# EAGLE design jogwheel (EAGLE 6.1)
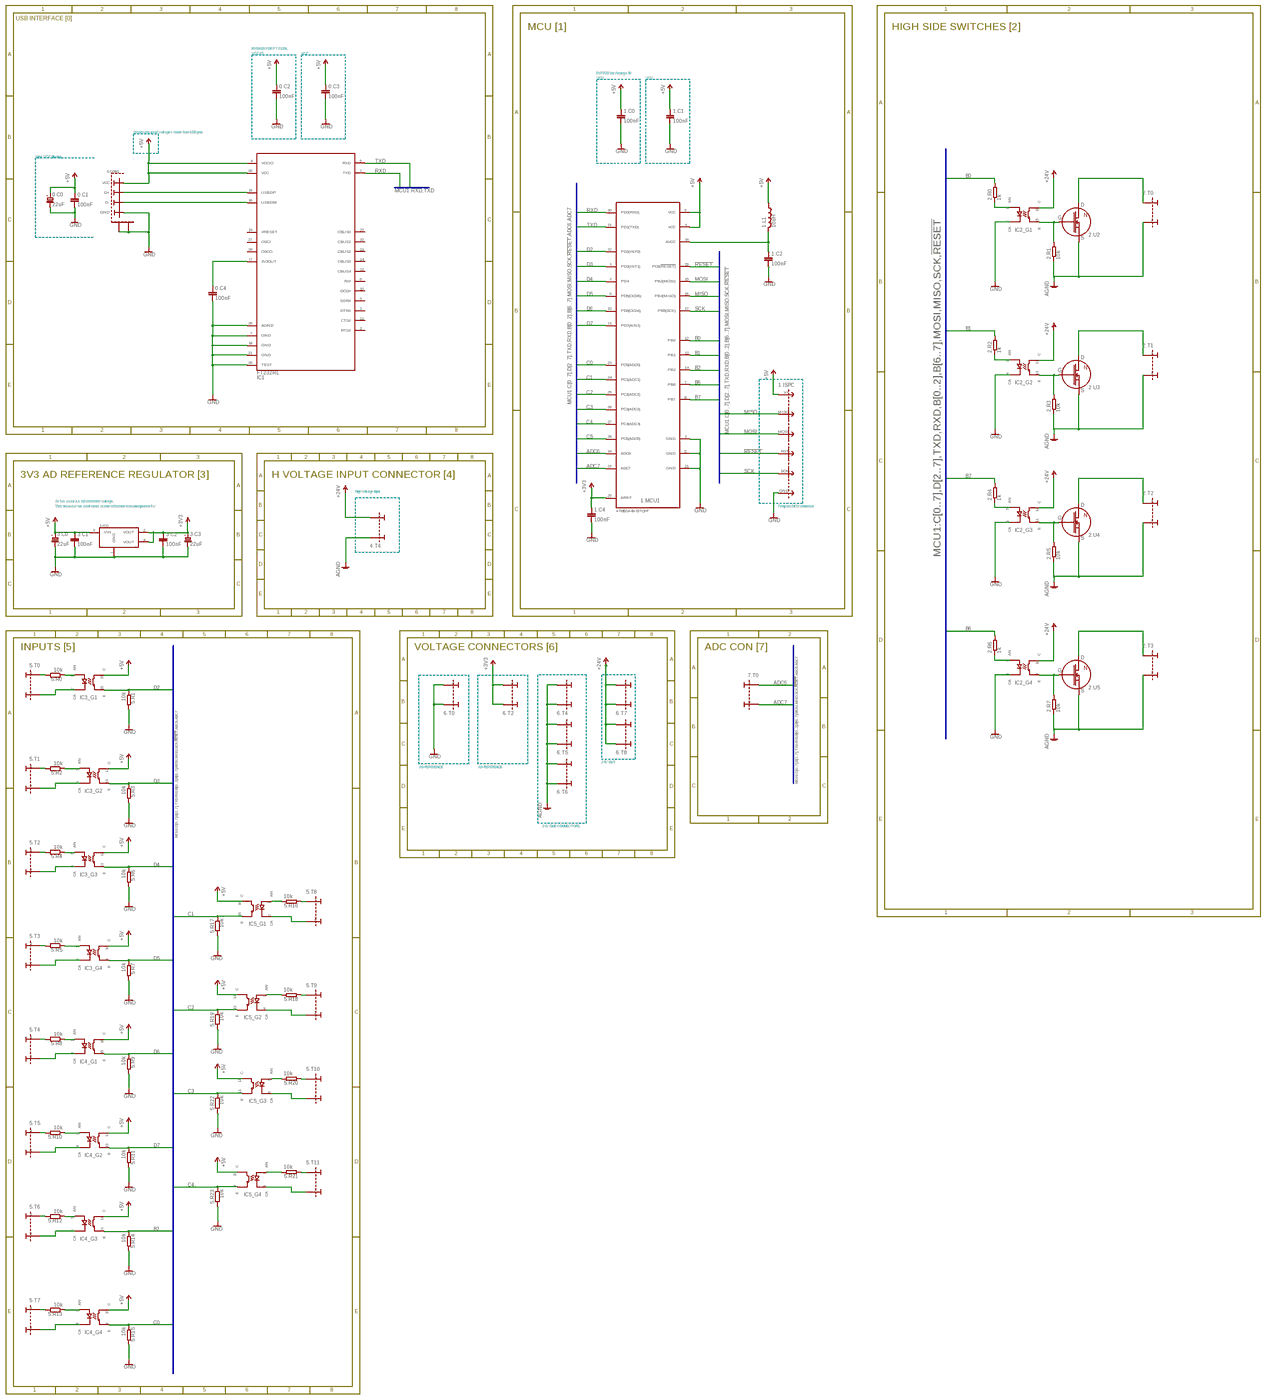
[diagram p0: schematic, sheet 1, overview]
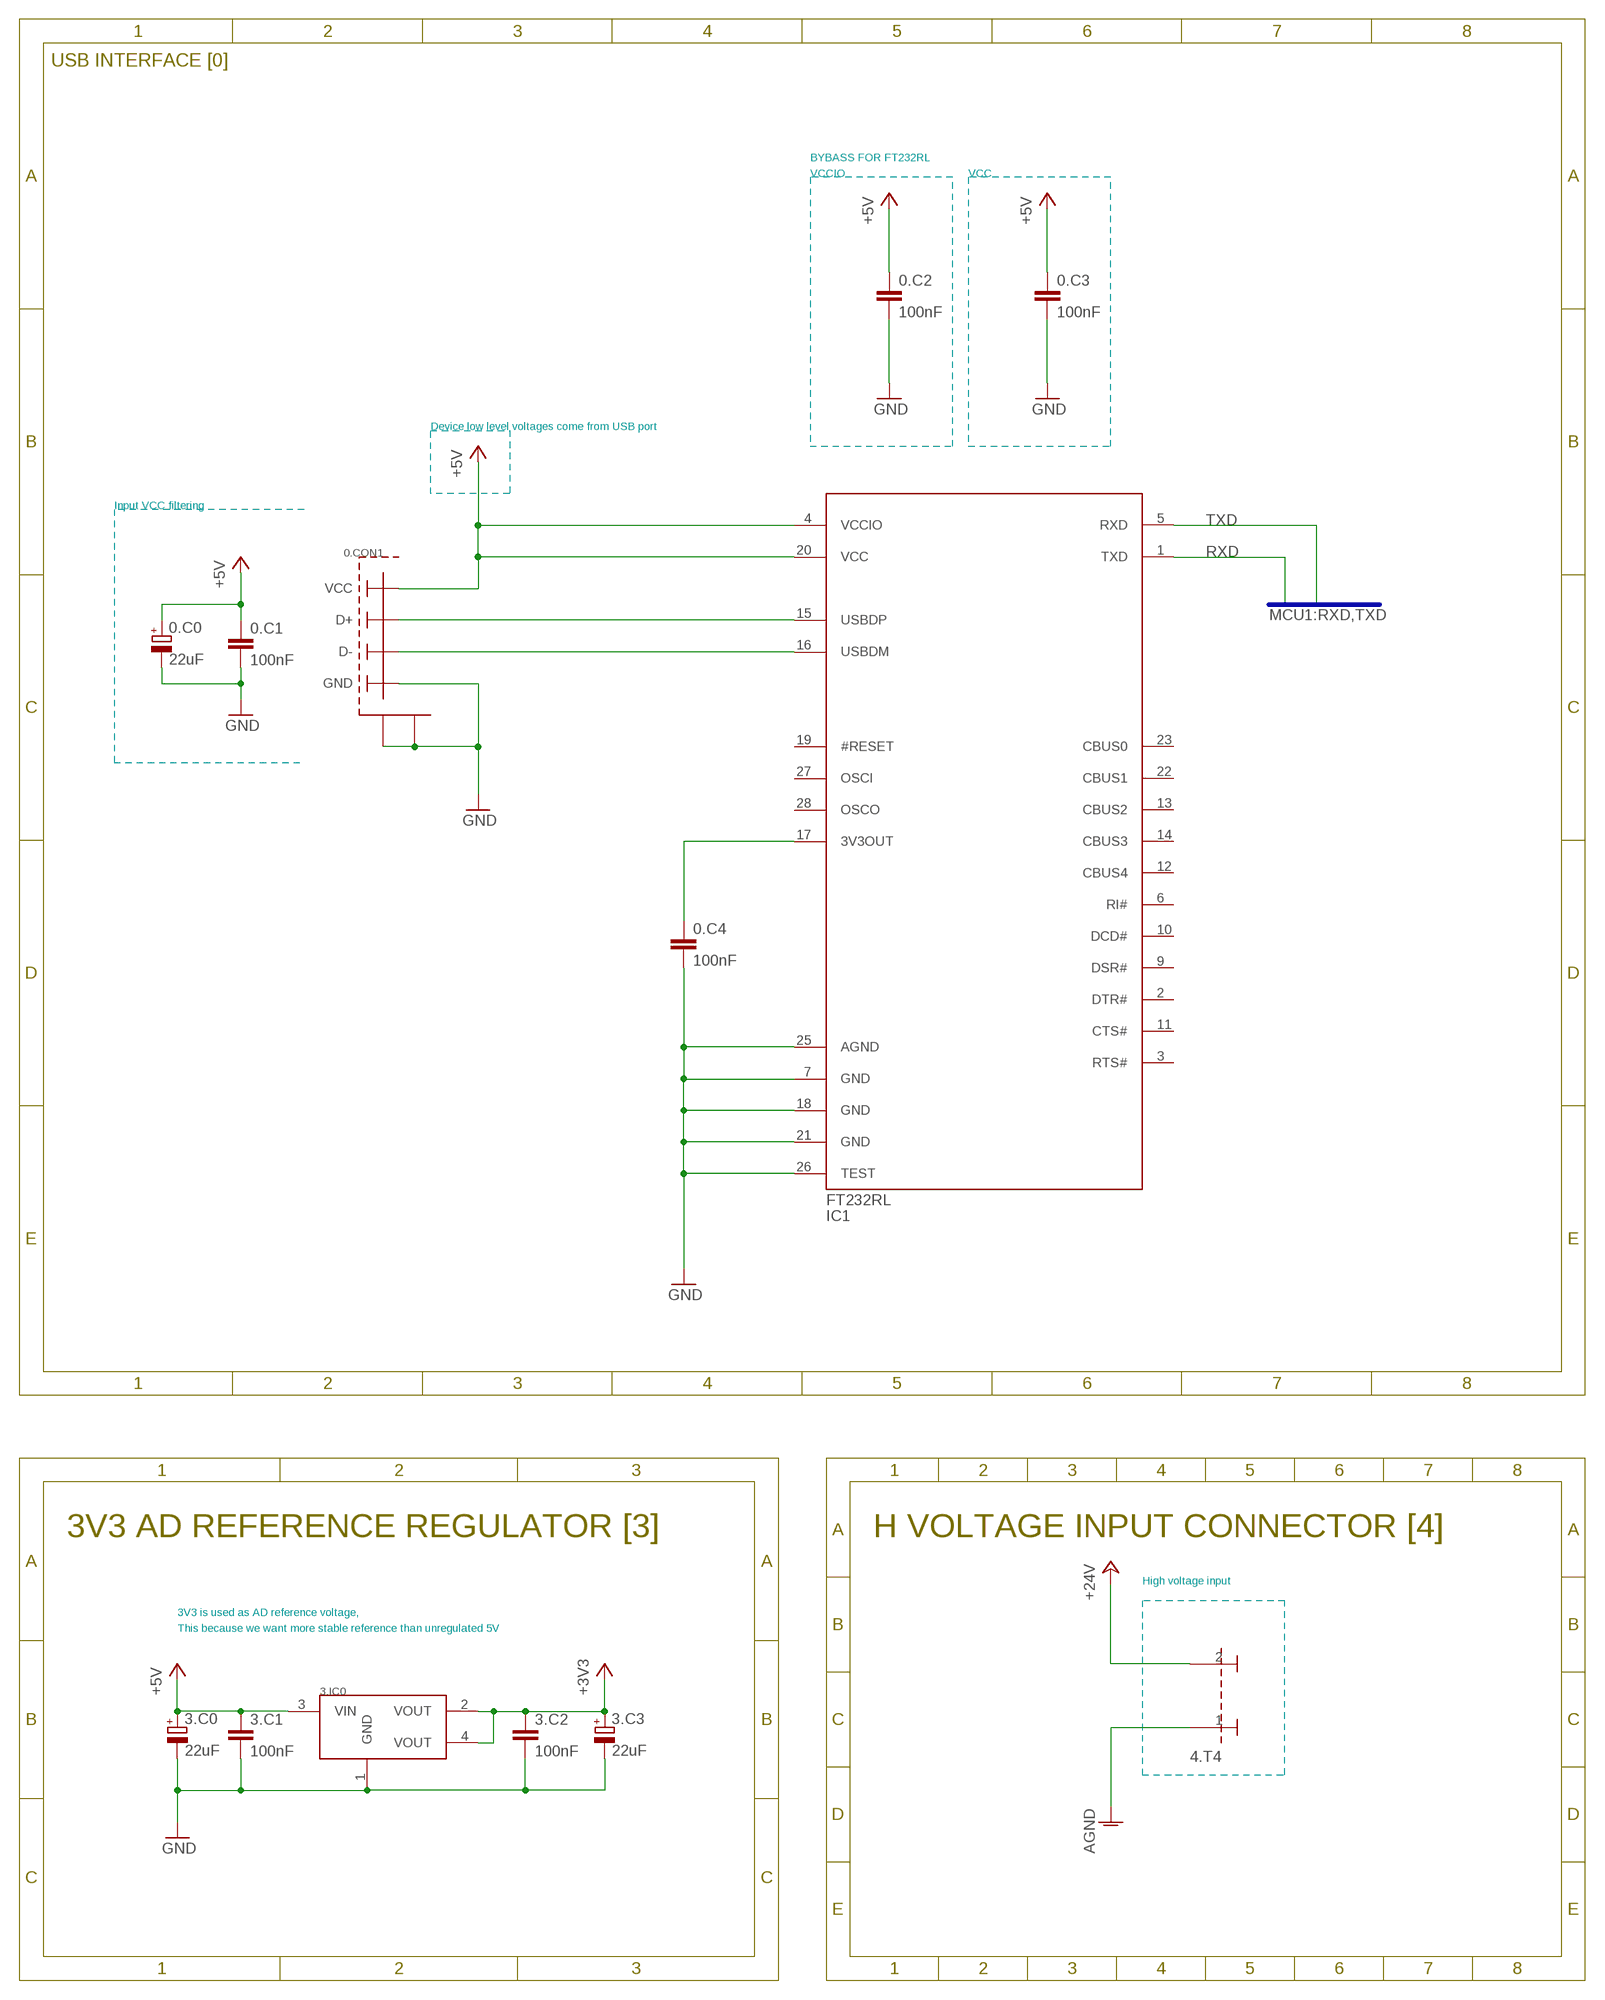
[diagram p1: schematic, sheet 1, part 1 of 4]
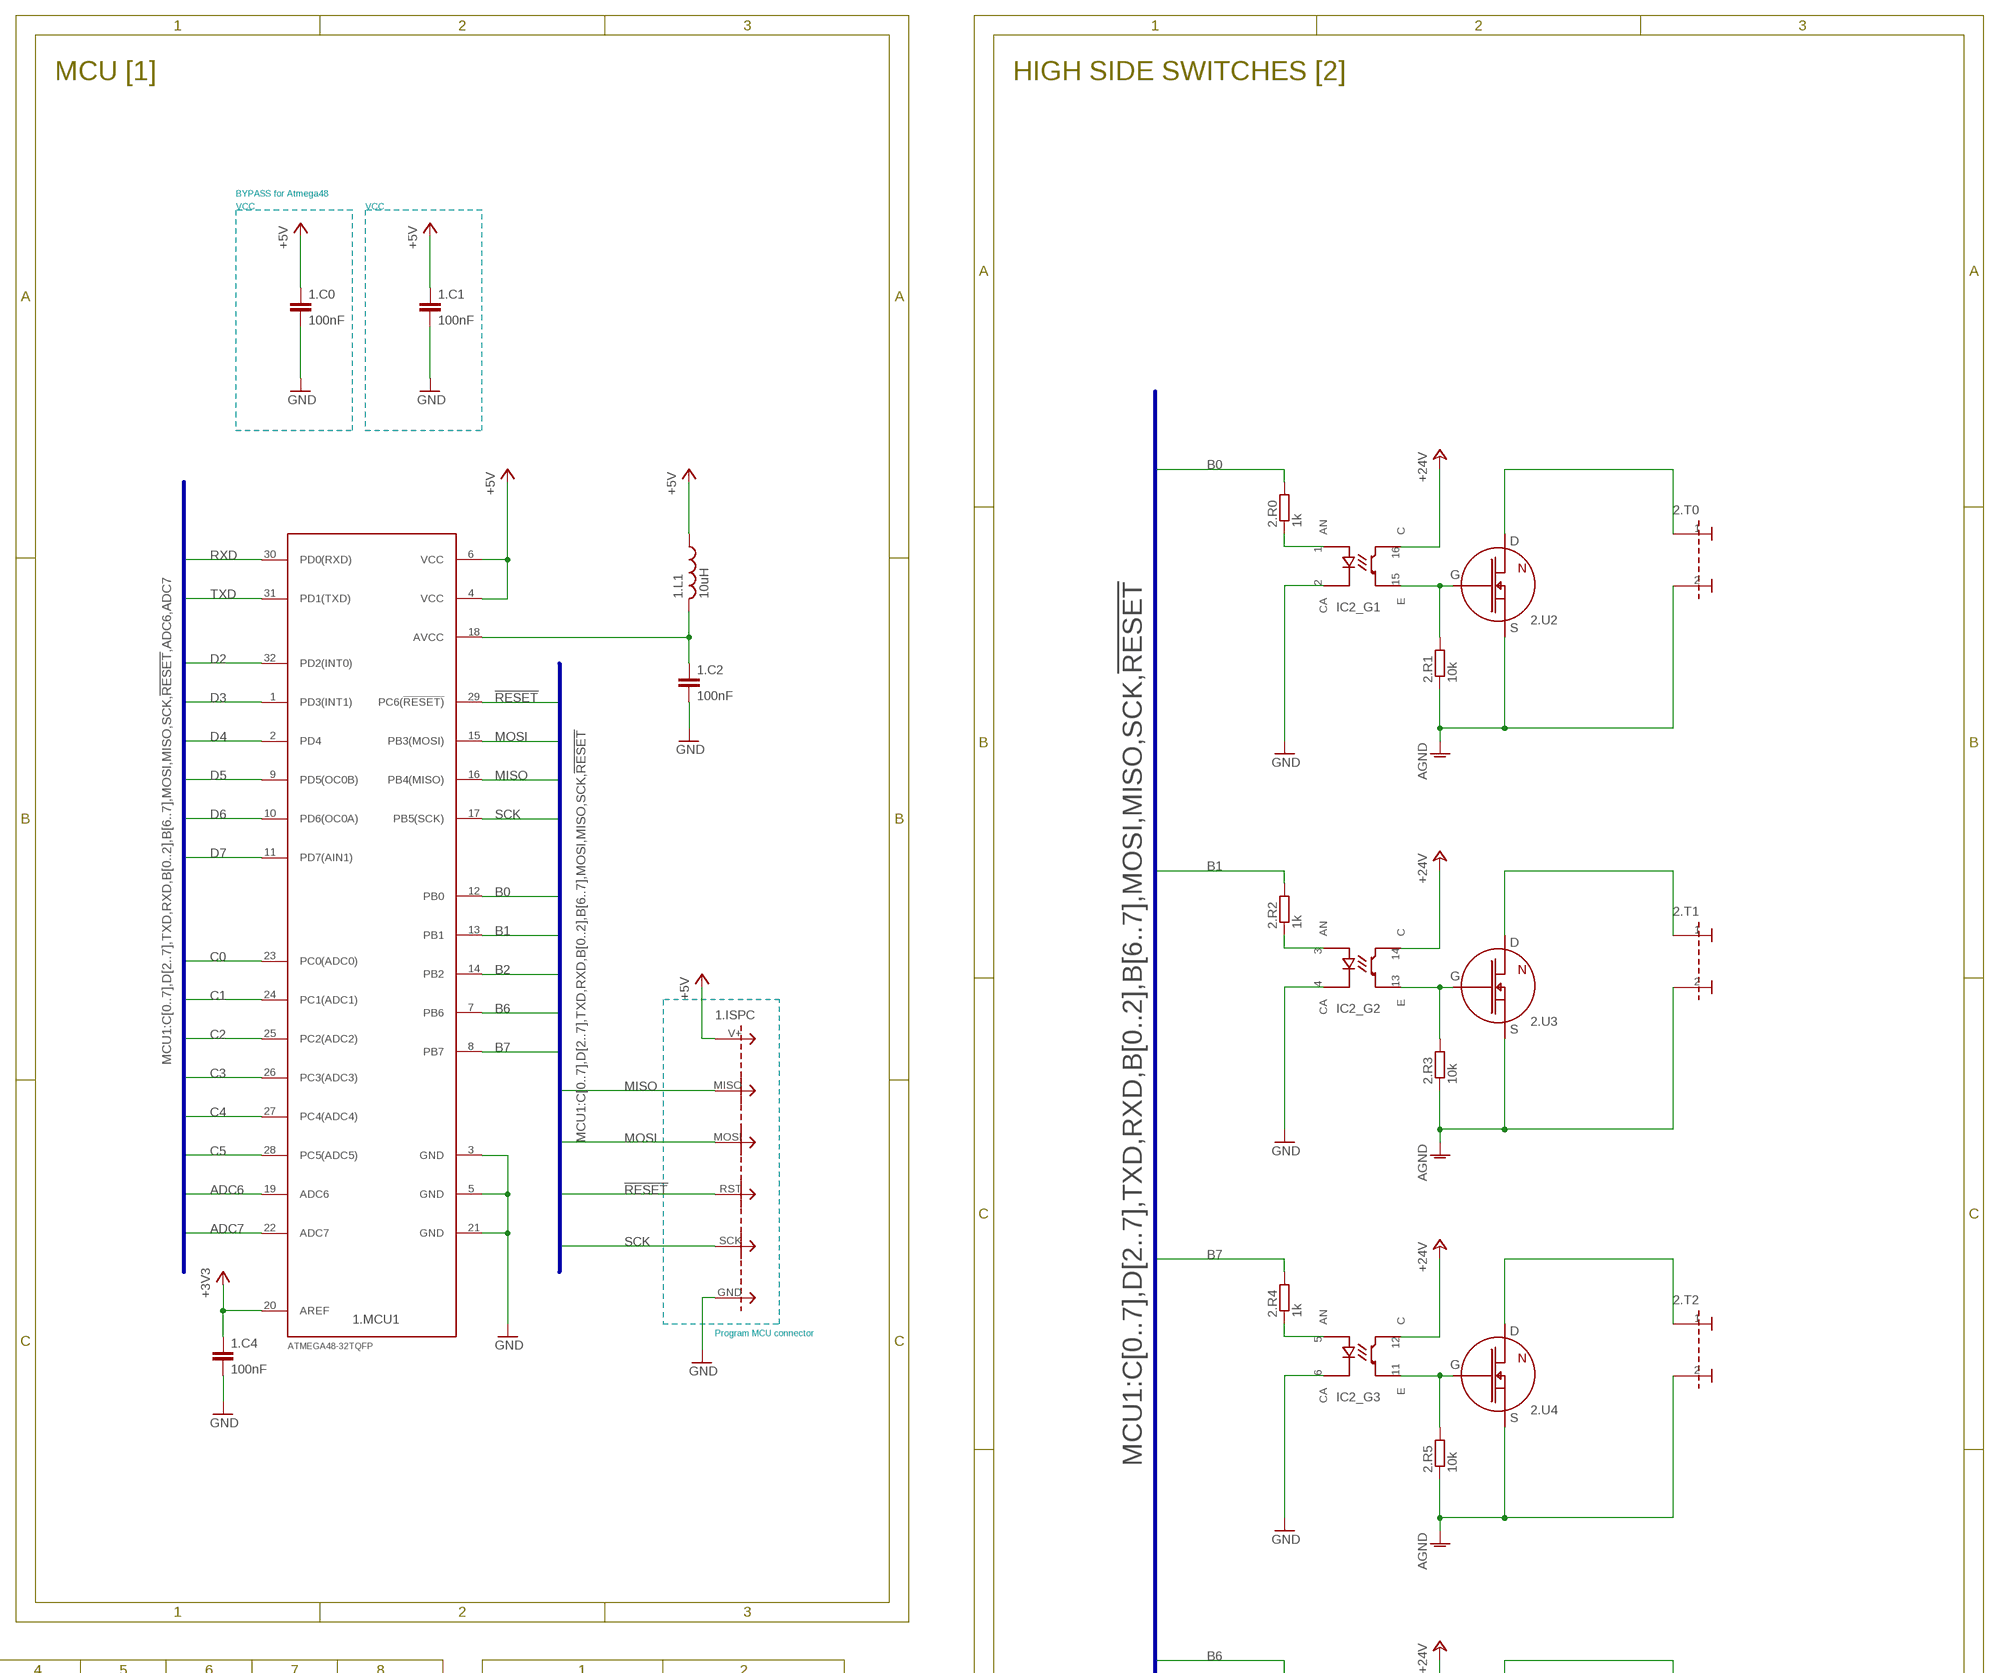
[diagram p2: schematic, sheet 1, part 2 of 4]
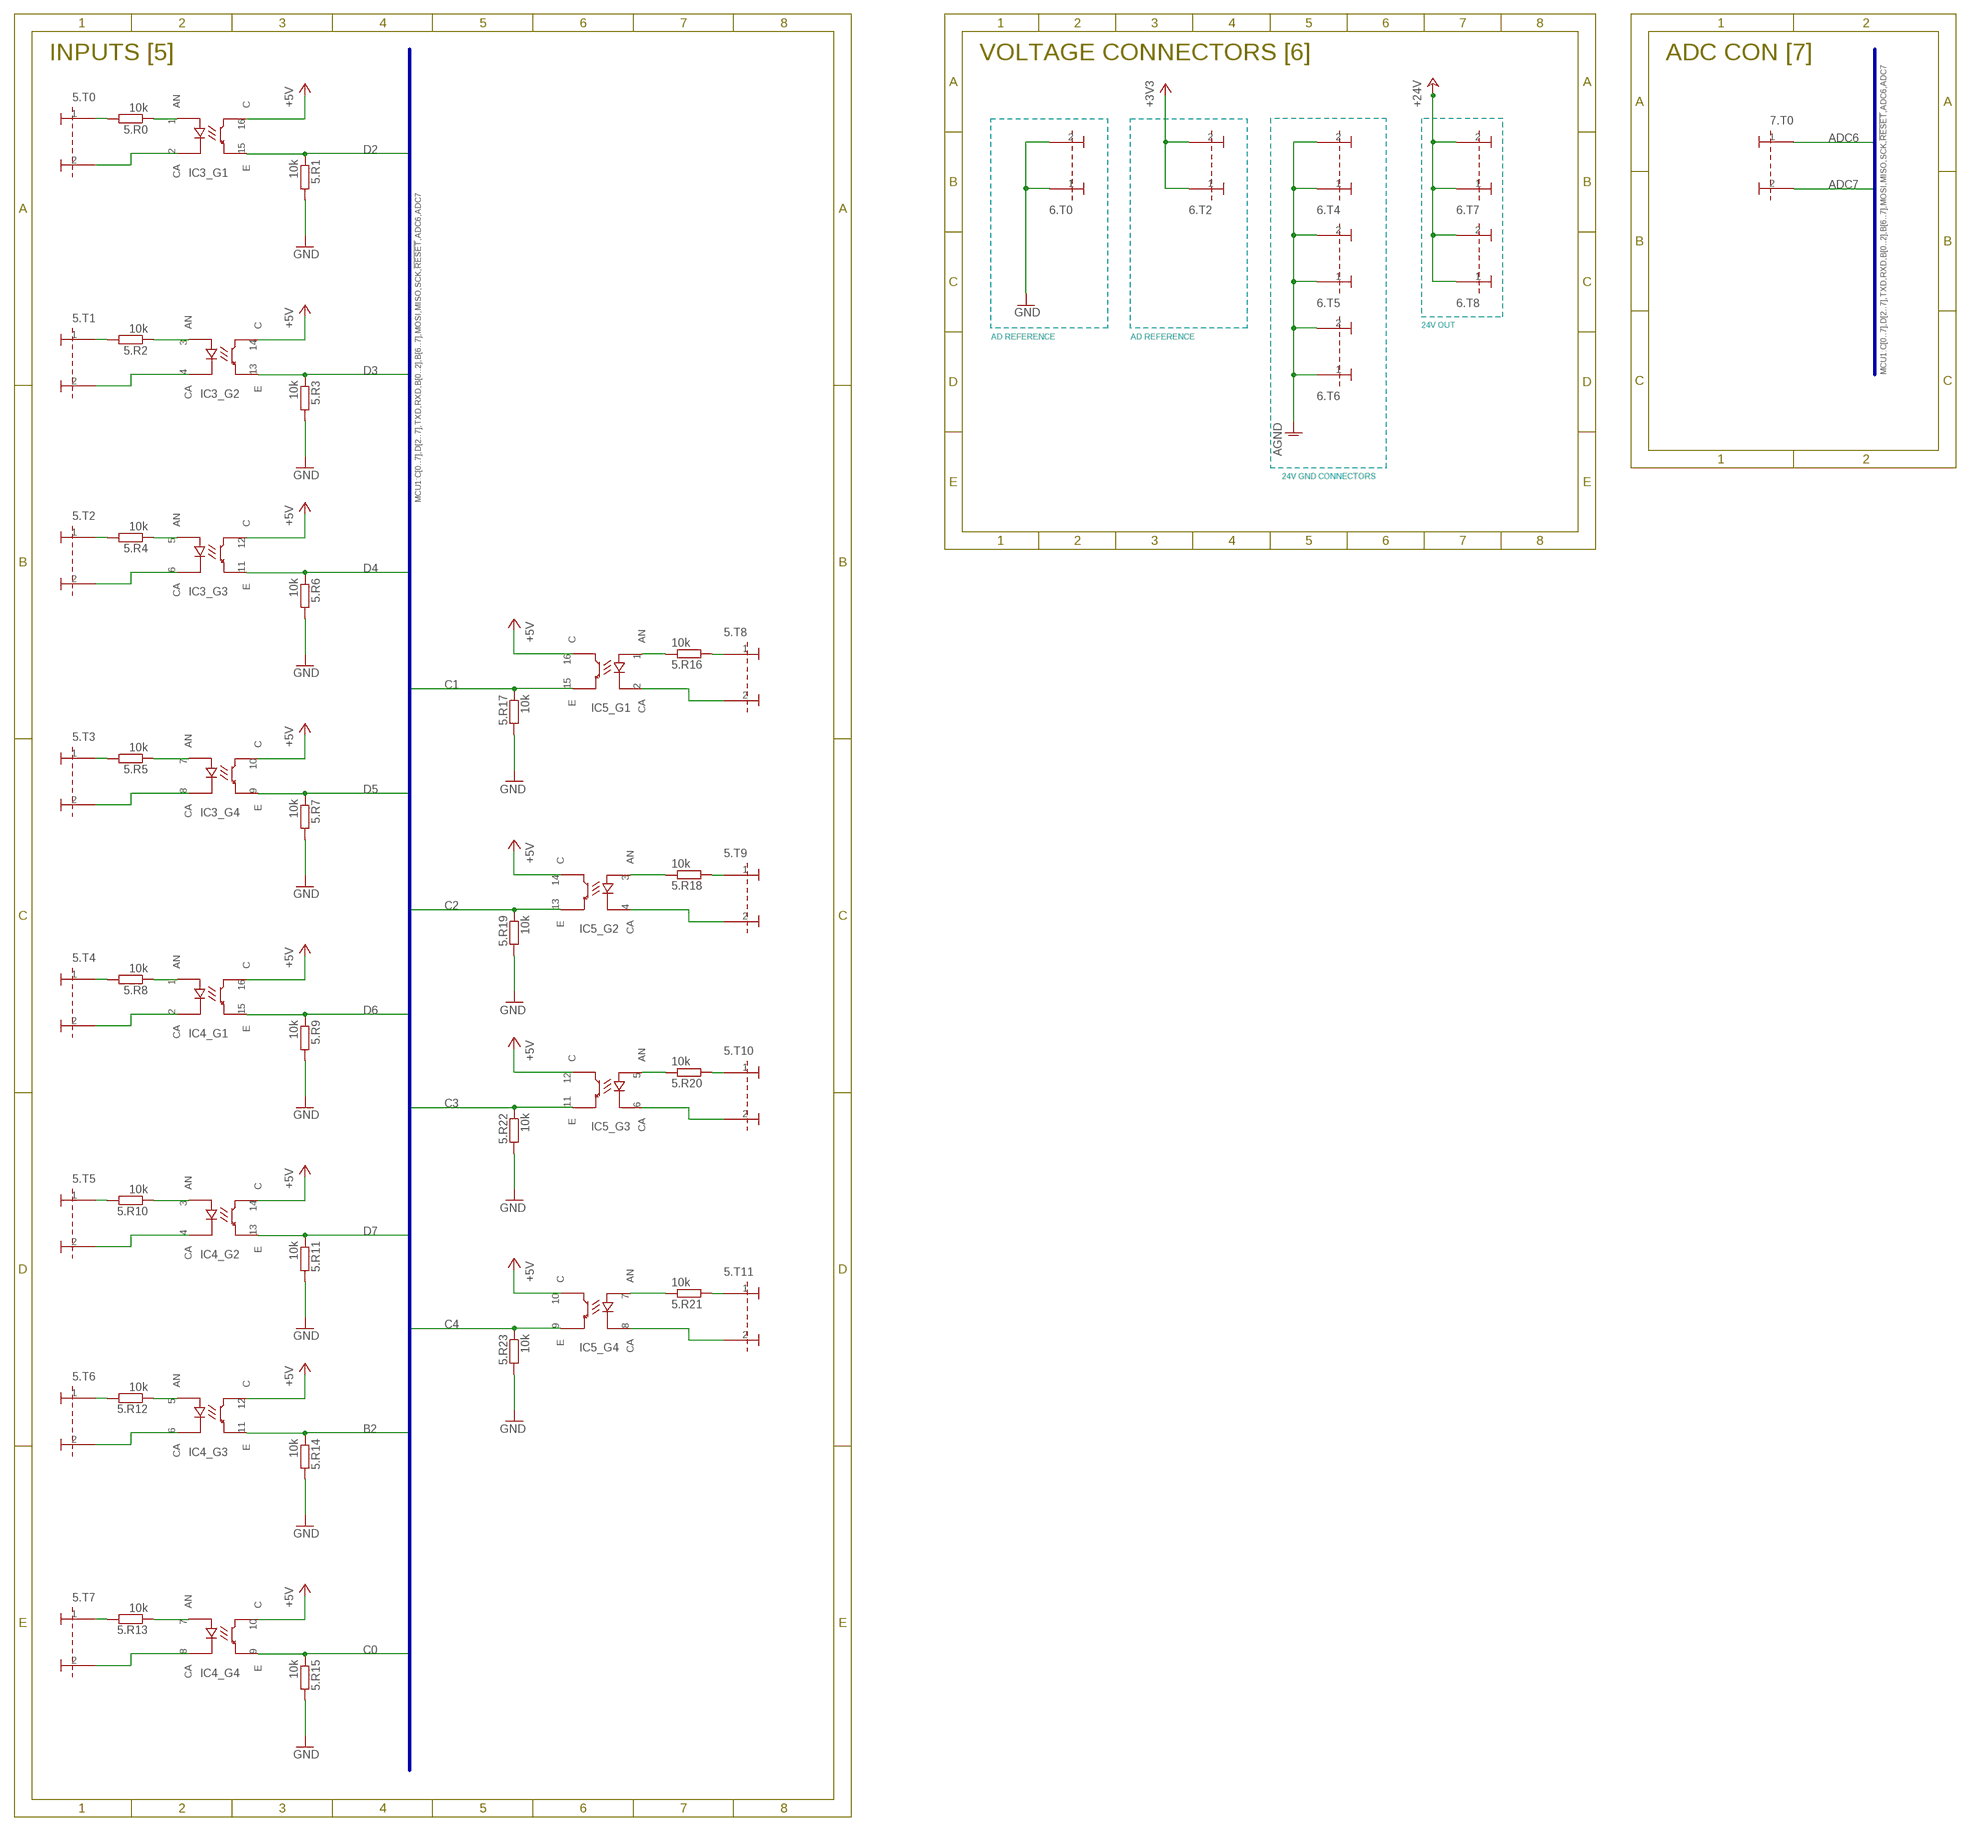
[diagram p3: schematic, sheet 1, part 3 of 4]
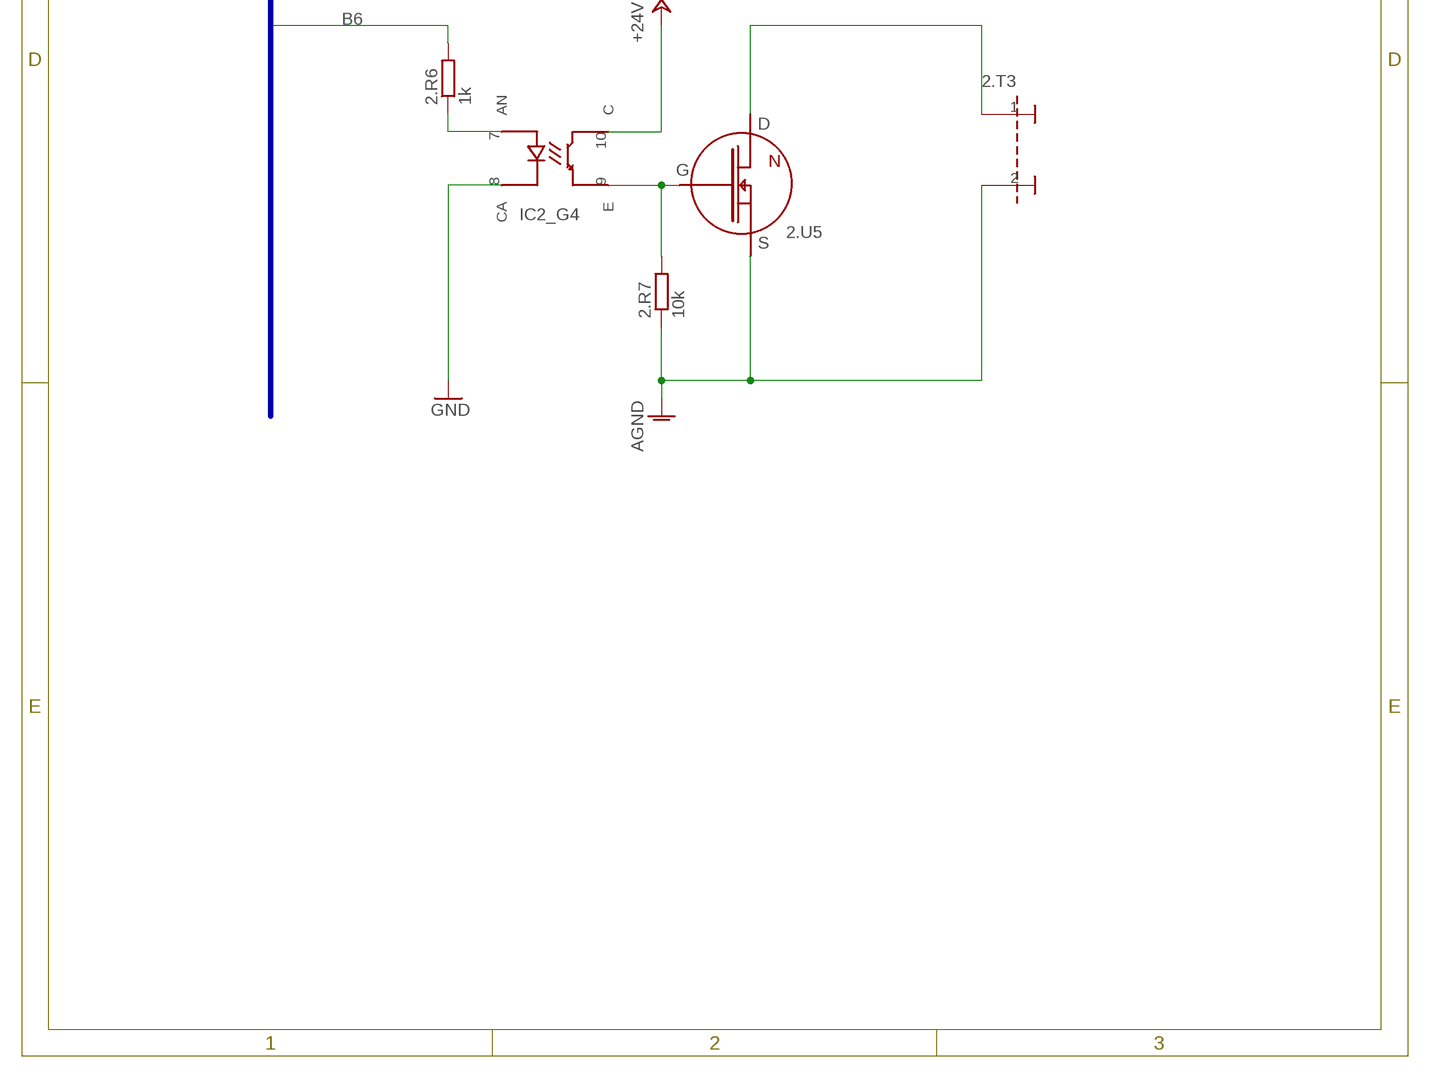
[diagram p4: schematic, sheet 1, part 4 of 4]

## Parts
0.C0  22uF  CPOL-EUE1.5-5  [E1.5-5]
0.C1  100nF  C-EUC0805  [C0805]
0.C2  100nF  C-EUC0805  [C0805]
0.C3  100nF  C-EUC0805  [C0805]
0.C4  100nF  C-EUC0805  [C0805]
0.CON1  USB-BWUERTH-ELECTRONIC-USB-B  [USB-B-THROUGH-HOLE]
1.C0  100nF  C-EUC0805  [C0805]
1.C1  100nF  C-EUC0805  [C0805]
1.C2  100nF  C-EUC0805  [C0805]
1.C4  100nF  C-EUC0805  [C0805]
1.ISPC  CONNECTOR_6PIN2X3_ISP  [2X3_ISP]
1.L1  10uH  L_10UH_0805_LB2012T100KR  [C0805]
1.MCU1  ATMEGA48-20PU-32TQFPTQFP32  [TQFP32-08]
2.R0  1k  R-EU_R0805  [R0805]
2.R1  10k  R-EU_R0805  [R0805]
2.R2  1k  R-EU_R0805  [R0805]
2.R3  10k  R-EU_R0805  [R0805]
2.R4  1k  R-EU_R0805  [R0805]
2.R5  10k  R-EU_R0805  [R0805]
2.R6  1k  R-EU_R0805  [R0805]
2.R7  10k  R-EU_R0805  [R0805]
2.T0  CONNECTOR_2PIN2W-TERMINAL-HEADER-20.155MV/2  [2WAY-TERMINAL-HEADER-20.155MV/2]
2.T1  CONNECTOR_2PIN2W-TERMINAL-HEADER-20.155MV/2  [2WAY-TERMINAL-HEADER-20.155MV/2]
2.T2  CONNECTOR_2PIN2W-TERMINAL-HEADER-20.155MV/2  [2WAY-TERMINAL-HEADER-20.155MV/2]
2.T3  CONNECTOR_2PIN2W-TERMINAL-HEADER-20.155MV/2  [2WAY-TERMINAL-HEADER-20.155MV/2]
2.U2  N_MOSFET_STD6NF10  [STD6NF10]
2.U3  N_MOSFET_STD6NF10  [STD6NF10]
2.U4  N_MOSFET_STD6NF10  [STD6NF10]
2.U5  N_MOSFET_STD6NF10  [STD6NF10]
3.C0  22uF  CPOL-EUE1.5-5  [E1.5-5]
3.C1  100nF  C-EUC0805  [C0805]
3.C2  100nF  C-EUC0805  [C0805]
3.C3  22uF  CPOL-EUE1.5-5  [E1.5-5]
3.IC0  REGULATOR_AP1117E33G-13  [SOT223]
4.T4  CONNECTOR_2PIN2W-TERMINAL-HEADER-20.155MV/2  [2WAY-TERMINAL-HEADER-20.155MV/2]
5.R0  10k  R-EU_R0805  [R0805]
5.R1  10k  R-EU_R0805  [R0805]
5.R2  10k  R-EU_R0805  [R0805]
5.R3  10k  R-EU_R0805  [R0805]
5.R4  10k  R-EU_R0805  [R0805]
5.R5  10k  R-EU_R0805  [R0805]
5.R6  10k  R-EU_R0805  [R0805]
5.R7  10k  R-EU_R0805  [R0805]
5.R8  10k  R-EU_R0805  [R0805]
5.R9  10k  R-EU_R0805  [R0805]
5.R10  10k  R-EU_R0805  [R0805]
5.R11  10k  R-EU_R0805  [R0805]
5.R12  10k  R-EU_R0805  [R0805]
5.R13  10k  R-EU_R0805  [R0805]
5.R14  10k  R-EU_R0805  [R0805]
5.R15  10k  R-EU_R0805  [R0805]
5.R16  10k  R-EU_R0805  [R0805]
5.R17  10k  R-EU_R0805  [R0805]
5.R18  10k  R-EU_R0805  [R0805]
5.R19  10k  R-EU_R0805  [R0805]
5.R20  10k  R-EU_R0805  [R0805]
5.R21  10k  R-EU_R0805  [R0805]
5.R22  10k  R-EU_R0805  [R0805]
5.R23  10k  R-EU_R0805  [R0805]
5.T0  CONNECTOR_2PIN2W-TERMINAL-HEADER-20.155MV/2  [2WAY-TERMINAL-HEADER-20.155MV/2]
5.T1  CONNECTOR_2PIN2W-TERMINAL-HEADER-20.155MV/2  [2WAY-TERMINAL-HEADER-20.155MV/2]
5.T2  CONNECTOR_2PIN2W-TERMINAL-HEADER-20.155MV/2  [2WAY-TERMINAL-HEADER-20.155MV/2]
5.T3  CONNECTOR_2PIN2W-TERMINAL-HEADER-20.155MV/2  [2WAY-TERMINAL-HEADER-20.155MV/2]
5.T4  CONNECTOR_2PIN2W-TERMINAL-HEADER-20.155MV/2  [2WAY-TERMINAL-HEADER-20.155MV/2]
5.T5  CONNECTOR_2PIN2W-TERMINAL-HEADER-20.155MV/2  [2WAY-TERMINAL-HEADER-20.155MV/2]
5.T6  CONNECTOR_2PIN2W-TERMINAL-HEADER-20.155MV/2  [2WAY-TERMINAL-HEADER-20.155MV/2]
5.T7  CONNECTOR_2PIN2W-TERMINAL-HEADER-20.155MV/2  [2WAY-TERMINAL-HEADER-20.155MV/2]
5.T8  CONNECTOR_2PIN2W-TERMINAL-HEADER-20.155MV/2  [2WAY-TERMINAL-HEADER-20.155MV/2]
5.T9  CONNECTOR_2PIN2W-TERMINAL-HEADER-20.155MV/2  [2WAY-TERMINAL-HEADER-20.155MV/2]
5.T10  CONNECTOR_2PIN2W-TERMINAL-HEADER-20.155MV/2  [2WAY-TERMINAL-HEADER-20.155MV/2]
5.T11  CONNECTOR_2PIN2W-TERMINAL-HEADER-20.155MV/2  [2WAY-TERMINAL-HEADER-20.155MV/2]
6.T0  CONNECTOR_2PIN2W-TERMINAL-HEADER-20.155MV/2  [2WAY-TERMINAL-HEADER-20.155MV/2]
6.T2  CONNECTOR_2PIN2W-TERMINAL-HEADER-20.155MV/2  [2WAY-TERMINAL-HEADER-20.155MV/2]
6.T4  CONNECTOR_2PIN2W-TERMINAL-HEADER-20.155MV/2  [2WAY-TERMINAL-HEADER-20.155MV/2]
6.T5  CONNECTOR_2PIN2W-TERMINAL-HEADER-20.155MV/2  [2WAY-TERMINAL-HEADER-20.155MV/2]
6.T6  CONNECTOR_2PIN2W-TERMINAL-HEADER-20.155MV/2  [2WAY-TERMINAL-HEADER-20.155MV/2]
6.T7  CONNECTOR_2PIN2W-TERMINAL-HEADER-20.155MV/2  [2WAY-TERMINAL-HEADER-20.155MV/2]
6.T8  CONNECTOR_2PIN2W-TERMINAL-HEADER-20.155MV/2  [2WAY-TERMINAL-HEADER-20.155MV/2]
7.T0  CONNECTOR_2PIN2W-TERMINAL-HEADER-20.155MV/2  [2WAY-TERMINAL-HEADER-20.155MV/2]
IC1  FT232RL  [SSOP28]
IC2  OPTO_4_CHANNELS  [ACPL-845-O300]
IC3  OPTO_4_CHANNELS  [ACPL-845-O300]
IC4  OPTO_4_CHANNELS  [ACPL-845-O300]
IC5  OPTO_4_CHANNELS  [ACPL-845-O300]

## Nets
!RESET: 1.ISPC.RST 1.MCU1.29(PC6(!RESET))
+3V3: 1.C4.1 1.MCU1.20(AREF) 3.C2.1 3.C3.+ 3.IC0.2(VOUT) 3.IC0.4(VOUT) 6.T2.1 6.T2.2
+5V: 0.C0.+ 0.C1.1 0.C2.1 0.C3.1 0.CON1.VCC 1.C0.1 1.C1.1 1.ISPC.V+ 1.L1.1 1.MCU1.4(VCC) 1.MCU1.6(VCC) 3.C0.+ 3.C1.1 3.IC0.3(VIN) IC1.4(VCCIO) IC1.20(VCC) IC3.10(_G4:C) IC3.12(_G3:C) IC3.14(_G2:C) IC3.16(_G1:C) IC4.10(_G4:C) IC4.12(_G3:C) IC4.14(_G2:C) IC4.16(_G1:C) IC5.10(_G4:C) IC5.12(_G3:C) IC5.14(_G2:C) IC5.16(_G1:C)
+24V: 4.T4.2 6.T7.1 6.T7.2 6.T8.1 6.T8.2 IC2.10(_G4:C) IC2.12(_G3:C) IC2.14(_G2:C) IC2.16(_G1:C)
ADC6: 1.MCU1.19(ADC6) 7.T0.1
ADC7: 1.MCU1.22(ADC7) 7.T0.2
AGND: 2.R1.1 2.R3.1 2.R5.1 2.R7.1 2.T0.2 2.T1.2 2.T2.2 2.T3.2 2.U2.3(S) 2.U3.3(S) 2.U4.3(S) 2.U5.3(S) 4.T4.1 6.T4.1 6.T4.2 6.T5.1 6.T5.2 6.T6.1 6.T6.2
AVCC: 1.C2.1 1.L1.2 1.MCU1.18(AVCC)
B0: 1.MCU1.12(PB0) 2.R0.2
B1: 1.MCU1.13(PB1) 2.R2.2
B2: 1.MCU1.14(PB2) 5.R14.1 IC4.11(_G3:E)
B6: 1.MCU1.7(PB6) 2.R6.2
B7: 1.MCU1.8(PB7) 2.R4.2
C0: 1.MCU1.23(PC0(ADC0)) 5.R15.1 IC4.9(_G4:E)
C1: 1.MCU1.24(PC1(ADC1)) 5.R17.1 IC5.15(_G1:E)
C2: 1.MCU1.25(PC2(ADC2)) 5.R19.1 IC5.13(_G2:E)
C3: 1.MCU1.26(PC3(ADC3)) 5.R22.1 IC5.11(_G3:E)
C4: 1.MCU1.27(PC4(ADC4)) 5.R23.1 IC5.9(_G4:E)
C5: 1.MCU1.28(PC5(ADC5))
D2: 1.MCU1.32(PD2(INT0)) 5.R1.1 IC3.15(_G1:E)
D3: 1.MCU1.1(PD3(INT1)) 5.R3.1 IC3.13(_G2:E)
D4: 1.MCU1.2(PD4) 5.R6.1 IC3.11(_G3:E)
D5: 1.MCU1.9(PD5(OC0B)) 5.R7.1 IC3.9(_G4:E)
D6: 1.MCU1.10(PD6(OC0A)) 5.R9.1 IC4.15(_G1:E)
D7: 1.MCU1.11(PD7(AIN1)) 5.R11.1 IC4.13(_G2:E)
GND: 0.C0.- 0.C1.2 0.C2.2 0.C3.2 0.C4.2 0.CON1.GND 0.CON1.SHIELD 0.CON1.SHIELD@2(SHIELD) 1.C0.2 1.C1.2 1.C2.2 1.C4.2 1.ISPC.GND 1.MCU1.3(GND) 1.MCU1.5(GND) 1.MCU1.21(GND) 3.C0.- 3.C1.2 3.C2.2 3.C3.- 3.IC0.1(GND) 5.R1.2 5.R3.2 5.R6.2 5.R7.2 5.R9.2 5.R11.2 5.R14.2 5.R15.2 5.R17.2 5.R19.2 5.R22.2 5.R23.2 6.T0.1 6.T0.2 IC1.7(GND) IC1.18(GND) IC1.21(GND) IC1.25(AGND) IC1.26(TEST) IC2.2(_G1:CA) IC2.4(_G2:CA) IC2.6(_G3:CA) IC2.8(_G4:CA)
MISO: 1.ISPC.MISO 1.MCU1.16(PB4(MISO))
MOSI: 1.ISPC.MOSI 1.MCU1.15(PB3(MOSI))
N$1 [+24V_SIGNAL]: 2.T2.1 2.U4.2(D)
N$2 [+24V_SIGNAL]: 2.T3.1 2.U5.2(D)
N$3: 0.CON1.D+ IC1.15(USBDP)
N$4: 0.CON1.D- IC1.16(USBDM)
N$5: 2.R5.2 2.U4.1(G) IC2.11(_G3:E)
N$6: 2.R7.2 2.U5.1(G) IC2.9(_G4:E)
N$7: 0.C4.1 IC1.17(3V3OUT)
N$8 [+24V_SIGNAL]: 2.T1.1 2.U3.2(D)
N$9: 2.R3.2 2.U3.1(G) IC2.13(_G2:E)
N$10 [+24V_SIGNAL]: 2.T0.1 2.U2.2(D)
N$11: 2.R1.2 2.U2.1(G) IC2.15(_G1:E)
N$12 [+24V_SIGNAL]: 5.R4.1 IC3.5(_G3:AN)
N$14 [+24V_SIGNAL]: 5.R5.1 IC3.7(_G4:AN)
N$15 [+24V_SIGNAL]: 5.R2.1 IC3.3(_G2:AN)
N$16: 2.R0.1 IC2.1(_G1:AN)
N$17: 2.R6.1 IC2.7(_G4:AN)
N$18 [+24V_SIGNAL]: 5.R2.2 5.T1.1
N$19: 2.R4.1 IC2.5(_G3:AN)
N$20 [+24V_SIGNAL]: 5.R0.1 IC3.1(_G1:AN)
N$21: 2.R2.1 IC2.3(_G2:AN)
N$22 [+24V_SIGNAL]: 5.T0.2 IC3.2(_G1:CA)
N$23 [+24V_SIGNAL]: 5.T1.2 IC3.4(_G2:CA)
N$24 [+24V_SIGNAL]: 5.R0.2 5.T0.1
N$25 [+24V_SIGNAL]: 5.T3.2 IC3.8(_G4:CA)
N$26 [+24V_SIGNAL]: 5.R5.2 5.T3.1
N$27 [+24V_SIGNAL]: 5.T2.2 IC3.6(_G3:CA)
N$28 [+24V_SIGNAL]: 5.R4.2 5.T2.1
N$29 [+24V_SIGNAL]: 5.R8.1 IC4.1(_G1:AN)
N$30 [+24V_SIGNAL]: 5.R10.1 IC4.3(_G2:AN)
N$31 [+24V_SIGNAL]: 5.T5.2 IC4.4(_G2:CA)
N$32 [+24V_SIGNAL]: 5.R10.2 5.T5.1
N$33 [+24V_SIGNAL]: 5.T4.2 IC4.2(_G1:CA)
N$34 [+24V_SIGNAL]: 5.R8.2 5.T4.1
N$35 [+24V_SIGNAL]: 5.R12.1 IC4.5(_G3:AN)
N$36 [+24V_SIGNAL]: 5.R13.1 IC4.7(_G4:AN)
N$37 [+24V_SIGNAL]: 5.T7.2 IC4.8(_G4:CA)
N$38 [+24V_SIGNAL]: 5.R13.2 5.T7.1
N$39 [+24V_SIGNAL]: 5.T6.2 IC4.6(_G3:CA)
N$40 [+24V_SIGNAL]: 5.R12.2 5.T6.1
N$41 [+24V_SIGNAL]: 5.R16.1 IC5.1(_G1:AN)
N$42 [+24V_SIGNAL]: 5.R18.1 IC5.3(_G2:AN)
N$43 [+24V_SIGNAL]: 5.T9.2 IC5.4(_G2:CA)
N$44 [+24V_SIGNAL]: 5.R18.2 5.T9.1
N$45 [+24V_SIGNAL]: 5.T8.2 IC5.2(_G1:CA)
N$46 [+24V_SIGNAL]: 5.R16.2 5.T8.1
N$47 [+24V_SIGNAL]: 5.R20.1 IC5.5(_G3:AN)
N$48 [+24V_SIGNAL]: 5.R21.1 IC5.7(_G4:AN)
N$49 [+24V_SIGNAL]: 5.T11.2 IC5.8(_G4:CA)
N$50 [+24V_SIGNAL]: 5.R21.2 5.T11.1
N$51 [+24V_SIGNAL]: 5.T10.2 IC5.6(_G3:CA)
N$52 [+24V_SIGNAL]: 5.R20.2 5.T10.1
RXD: 1.MCU1.30(PD0(RXD)) IC1.1(TXD)
SCK: 1.ISPC.SCK 1.MCU1.17(PB5(SCK))
TXD: 1.MCU1.31(PD1(TXD)) IC1.5(RXD)
Unconnected: IC1.2(DTR#) IC1.3(RTS#) IC1.6(RI#) IC1.9(DSR#) IC1.10(DCD#) IC1.11(CTS#) IC1.12(CBUS4) IC1.13(CBUS2) IC1.14(CBUS3) IC1.19(#RESET) IC1.22(CBUS1) IC1.23(CBUS0) IC1.27(OSCI) IC1.28(OSCO)

## Buses
MCU1:C[0..7],D[2..7],TXD,RXD,B[0..2],B[6..7],MOSI,MISO,SCK,!RESET
MCU1:C[0..7],D[2..7],TXD,RXD,B[0..2],B[6..7],MOSI,MISO,SCK,!RESET,ADC6,ADC7
MCU1:RXD,TXD

## Notes on the sheet
- USB INTERFACE [0]
- MCU [1] | HIGH SIDE SWITCHES [2]
- BYBASS FOR FT232RL
- VCCIO | VCC
- BYPASS for Atmega48
- VCC | VCC
- Device low level voltages come from USB port
- Input VCC filtering
- 3V3 AD REFERENCE REGULATOR [3] | H VOLTAGE INPUT CONNECTOR [4]
- High voltage input
- 3V3 is used as AD reference voltage,
- This because we want more stable reference than unregulated 5V | Program MCU connector
- INPUTS [5] | VOLTAGE CONNECTORS [6] | ADC CON [7]
- 24V OUT
- AD REFERENCE | AD REFERENCE
- 24V GND CONNECTORS

## Library data of the parts
0.C0 3.C0 3.C3 = RC_and_L:CPOL-EU: POLARIZED CAPACITOR, European symbol
0.C1-0.C4 1.C0 1.C1 1.C2 1.C4 3.C1 3.C2 = RC_and_L:C-EU: CAPACITOR, European symbol
0.CON1 = tlcamera_rail_to_manufacture:USB-B: USB, type B connector.; DATASHEET: http://www.farnell.com/datasheets/1442182.pdf; FARNELL: http://fi.farnell.com/jsp/search/productdetail.jsp?SKU=1642035
1.ISPC = connectors:CONNECTOR_6PIN
1.L1 = jogwheel_parts:L_10UH_0805_LB2012T100KR: TAIYO YUDEN - LB2012T100KR - INDUCTOR, 0805 CASE, 10UH, 120MA, 10% Farnell <http://fi.farnell.com/taiyo-yuden/lb2012t100kr/inductor-0805-case-10uh-120ma-10/dp/1463501>
1.MCU1 = jogwheel_parts:ATMEGA48-20PU-32TQFP
2.R0 2.R1-2.R7 5.R0 5.R1-5.R23 = RC_and_L:R-EU_: RESISTOR, European symbol
2.T0 2.T1-2.T3 = connectors:CONNECTOR_2PIN; PIN1: DRAIN; PIN2: AGND
2.U2-2.U5 = jogwheel_parts:N_MOSFET: MOSFET, N CHANNEL, SINGLE, 3PIN
3.IC0 = jogwheel_parts:REGULATOR: 3V3 Fixed voltage regulator. (2 pins out).; DATASHEET: http://www.farnell.com/datasheets/608751.pdf; FARNELL: http://fi.farnell.com/diodes-inc/ap1117e33g-13/ic-ldo-reg-3-3v-sot223/dp/1825291
4.T4 = connectors:CONNECTOR_2PIN; PIN1: AGND; PIN2: 24VIN
5.T0 5.T1-5.T11 = connectors:CONNECTOR_2PIN; PIN1: V+; PIN2: V-
6.T0 = connectors:CONNECTOR_2PIN; PIN1: GND; PIN2: GND
6.T2 = connectors:CONNECTOR_2PIN; PIN1: AREF; PIN2: AREF
6.T4-6.T6 = connectors:CONNECTOR_2PIN; PIN1: AGND; PIN2: AGND
6.T7 6.T8 = connectors:CONNECTOR_2PIN; PIN1: 24V; PIN2: 24V
7.T0 = connectors:CONNECTOR_2PIN; PIN1: ADC0; PIN2: ADC1
IC1 = jogwheel_parts:FT232RL: FTDI - FT232RL - IC, USB TO UART, SMD, SSOP28, 232; DATASHEET: http://www.farnell.com/datasheets/11529.pdf; FARNELL: http://fi.farnell.com/ftdi/ft232rl/ic-usb-to-uart-smd-ssop28-232/dp/1146032
IC2-IC5 = jogwheel_parts:OPTO_4_CHANNELS: 4 CHANNEL OPTOCOUPLER IC

## Net classes
0 default: width 0.305 mm
1 +24V: width 0.61 mm, clearance 0.305 mm
2 +24V_SIGNAL: width 0.61 mm, clearance 0.305 mm

## Board
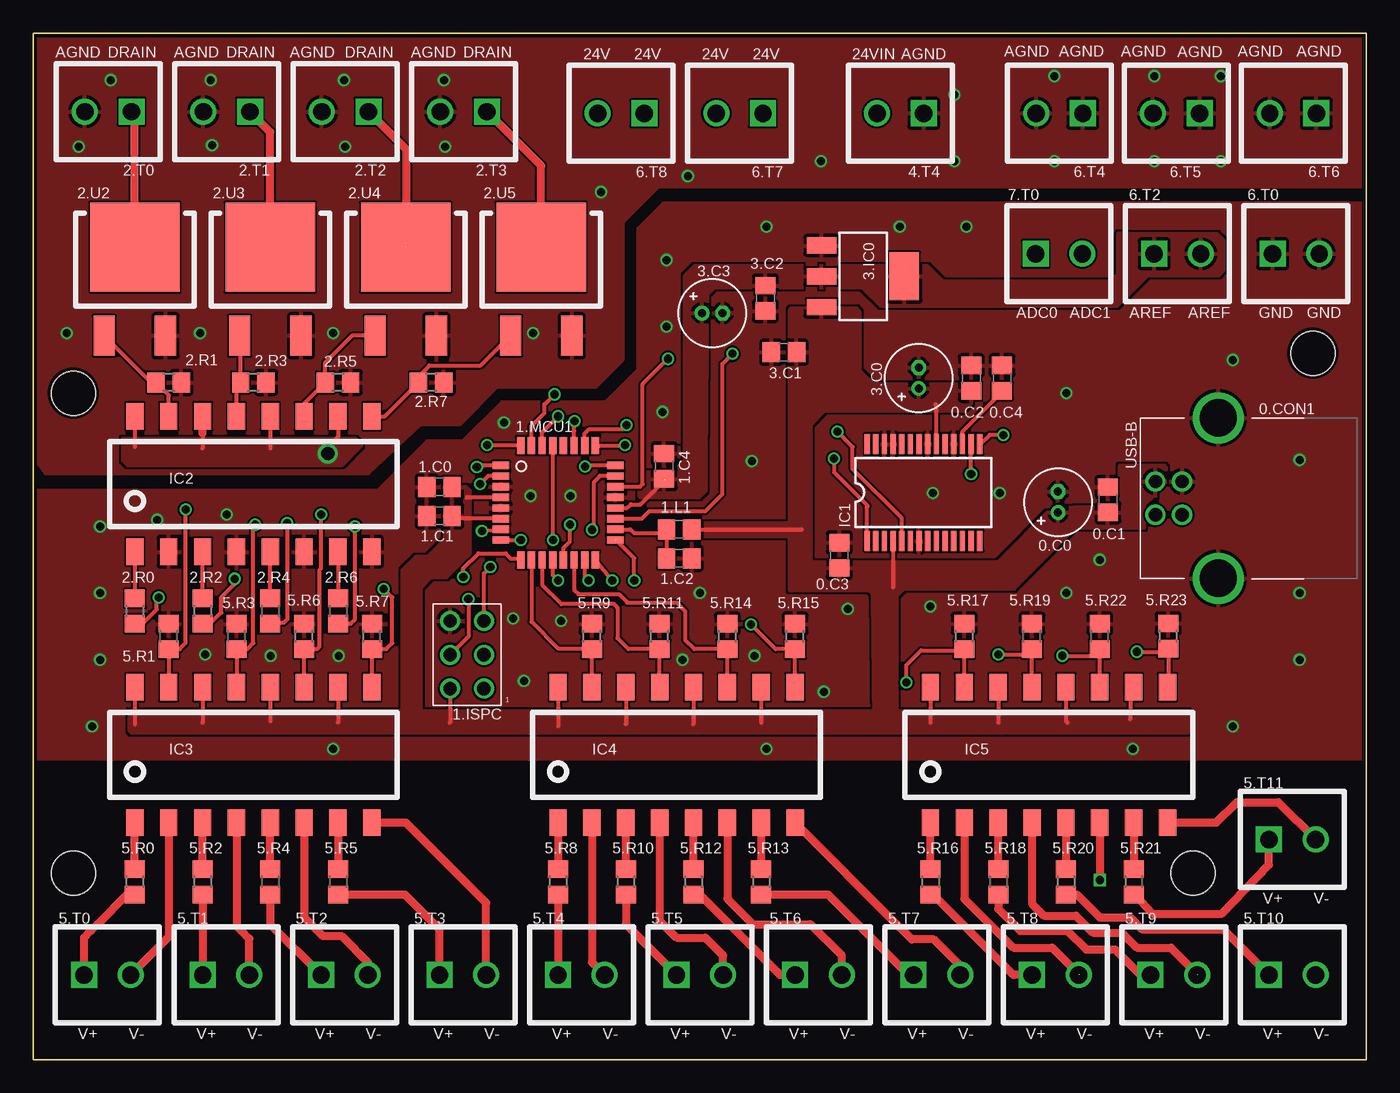
[diagram p5: board, top side]
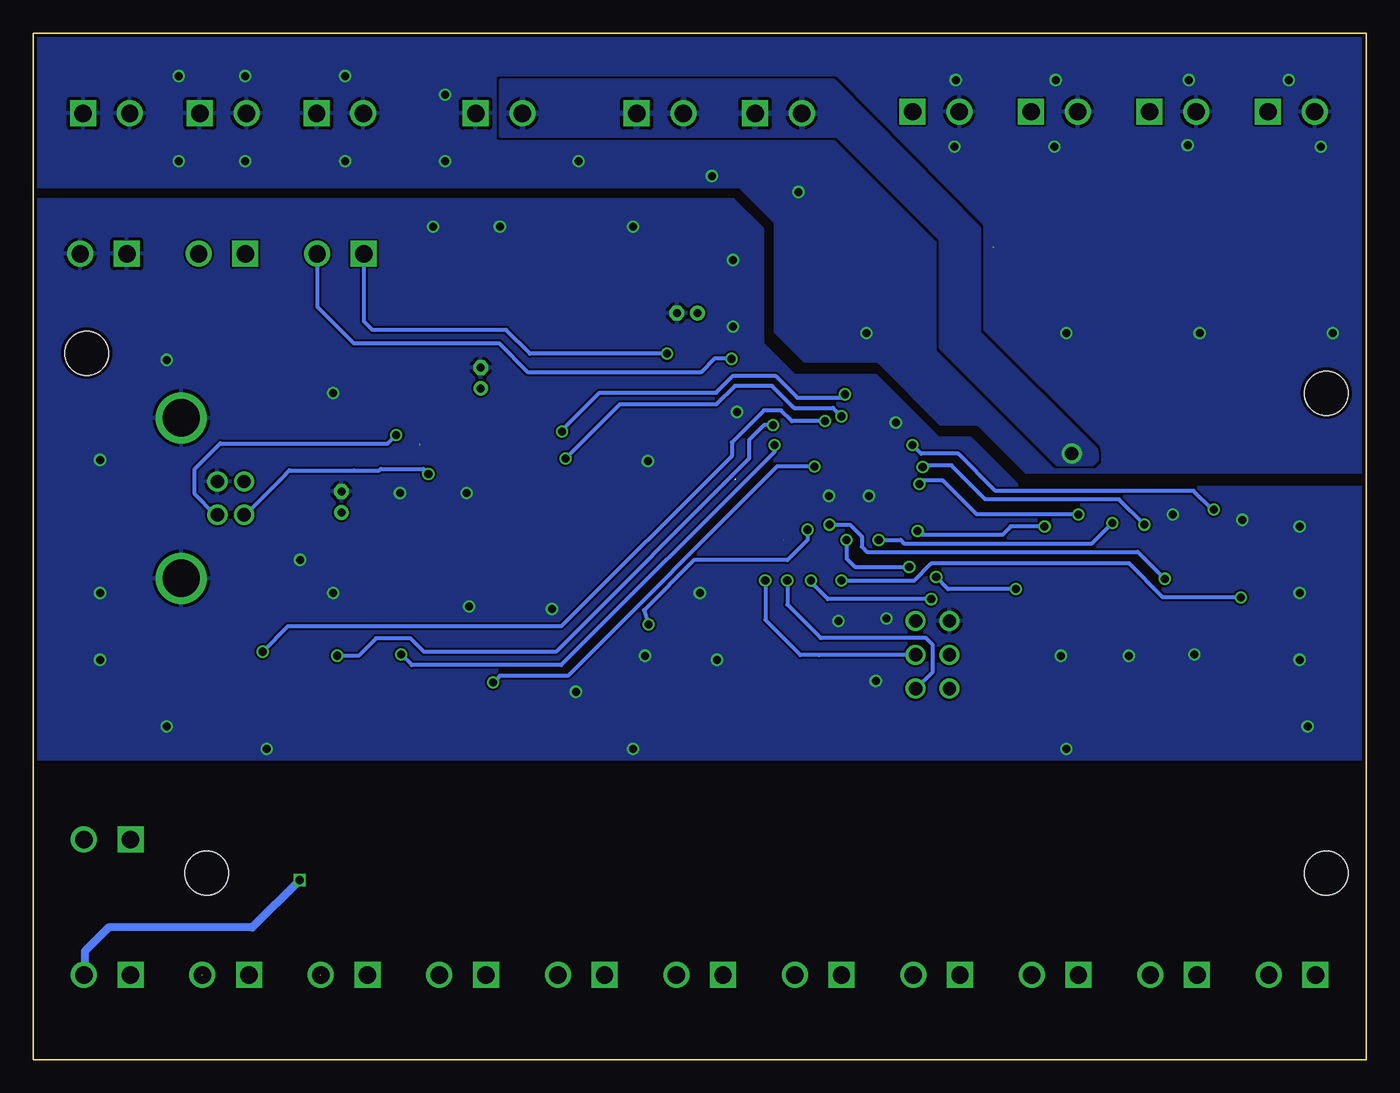
[diagram p6: board, bottom side, seen from below]

Size 100 x 77 mm. Coordinates in mm from the lower left corner, seen from the top.
Outline: 0,0 0,77 100,77 100,0 0,0
Copper layers (1*16): Top 0.035mm / dielectric 1.5mm / Bottom 0.035mm
Design rules: minimum track width 6mil, minimum drill 12mil, track to track 6mil, track to pad 6mil, pad to pad 6mil, via to via 6mil, smd to smd 0mil, copper to edge 10mil, drill to drill 10mil, minimum pad ring 10mil, minimum via ring 6mil, stop-mask expansion 2mil, vias tented up to drill 100mil, thermal gap 10mil
Holes 3.3 mm at 3,14 87,14 96,53 3,50

### Footprints (pad centres in the part's own frame; a part is rotated, then mirrored left to right if it is on the bottom)
E1.5-5 = drill 0.6: + -0.77,0 | drill 0.6 octagon: - 0.79,0
C0805 = smd 1.3 x 1.5: 1 -0.95,0; 2 0.95,0
USB-B-THROUGH-HOLE = drill 1: D+ 7.27,-2.71; D- 7.27,-4.71; GND 4.77,-2.71; VCC 4.77,-4.71 | drill 2.8: SHIELD 0,0; SHIELD@2 12.04,0
2X3_ISP = drill 1: GND 1.27,-5.08; MISO -1.27,0; MOSI 1.27,-2.54; RST -1.27,-5.08; SCK -1.27,-2.54; V+ 1.27,0
TQFP32-08 = smd 1.27 x 0.559: 1 -4.293,2.8; 2 -4.293,2; 3 -4.293,1.2; 4 -4.293,0.4; 5 -4.293,-0.4; 6 -4.293,-1.2; 7 -4.293,-2; 8 -4.293,-2.8; 17 4.293,-2.8; 18 4.293,-2; 19 4.293,-1.2; 20 4.293,-0.4; 21 4.293,0.4; 22 4.293,1.2; 23 4.293,2; 24 4.293,2.8 | smd 0.559 x 1.27: 9 -2.8,-4.293; 10 -2,-4.293; 11 -1.2,-4.293; 12 -0.4,-4.293; 13 0.4,-4.293; 14 1.2,-4.293; 15 2,-4.293; 16 2.8,-4.293; 25 2.8,4.293; 26 2,4.293; 27 1.2,4.293; 28 0.4,4.293; 29 -0.4,4.293; 30 -1.2,4.293; 31 -2,4.293; 32 -2.8,4.293
R0805 = smd 1.3 x 1.5: 1 -0.95,0; 2 0.95,0
2WAY-TERMINAL-HEADER-20.155MV/2 = drill 1.3 square: 1 0,0 | drill 1.3: 2 3.5,0
STD6NF10 = smd 1.6 x 3: 1 -2.3,-6.65; 3 2.3,-6.65 | smd 6.7 x 6.7: 2 0,0
SOT223 = smd 1.219 x 2.235: 1 -2.311,-3.099; 2 0,-3.099; 3 2.311,-3.099 | smd 3.6 x 2.2: 4 0,3.099
SSOP28 = smd 0.4 x 1.5: 1 -4.225,-3.625; 2 -3.575,-3.625; 3 -2.925,-3.625; 4 -2.275,-3.625; 5 -1.625,-3.625; 6 -0.975,-3.625; 7 -0.325,-3.625; 8 0.325,-3.625; 9 0.975,-3.625; 10 1.625,-3.625; 11 2.275,-3.625; 12 2.925,-3.625; 13 3.575,-3.625; 14 4.225,-3.625; 15 4.225,3.625; 16 3.575,3.625; 17 2.925,3.625; 18 2.275,3.625; 19 1.625,3.625; 20 0.975,3.625; 21 0.325,3.625; 22 -0.325,3.625; 23 -0.975,3.625; 24 -1.625,3.625; 25 -2.275,3.625; 26 -2.925,3.625; 27 -3.575,3.625; 28 -4.225,3.625
ACPL-845-O300 = smd 1.3 x 2: 1 0,-10.16; 2 2.54,-10.16; 3 5.08,-10.16; 4 7.62,-10.16; 5 10.16,-10.16; 6 12.7,-10.16; 7 15.24,-10.16; 8 17.78,-10.16; 9 17.78,0; 10 15.24,0; 11 12.7,0; 12 10.16,0; 13 7.62,0; 14 5.08,0; 15 2.54,0; 16 0,0

### Placement (x,y rotation side)
0.C0  76.88,41.82 90 top
0.C1  80.62,42.01 90 top
0.C2  70.38,51.13 90 top
0.C3  60.47,37.84 90 top
0.C4  72.67,51.13 90 top
0.CON1  88.9,48.14 270 top
1.C0  30.47,42.97 180 top
1.C1  30.47,40.8 180 top
1.C2  48.45,37.61 0 top
1.C4  47.33,44.51 90 top
1.ISPC  32.54,27.83 180 top
1.L1  48.45,39.78 180 top
1.MCU1  39.37,41.78 0 top
2.R0  7.62,33.66 270 top
2.R1  10.16,50.8 180 top
2.R2  12.7,33.66 270 top
2.R3  16.51,50.8 180 top
2.R4  17.78,33.66 270 top
2.R5  22.86,50.8 180 top
2.R6  22.86,33.66 270 top
2.R7  29.84,50.8 180 top
2.T0  7.37,71.12 180 top
2.T1  16.25,71.12 180 top
2.T2  25.14,71.12 180 top
2.T3  34.03,71.12 180 top
2.U2  7.62,60.96 0 top
2.U3  17.78,60.96 0 top
2.U4  27.94,60.96 0 top
2.U5  38.1,60.96 0 top
3.C0  66.43,51.13 90 top
3.C1  56.31,53.06 180 top
3.C2  54.93,57.12 270 top
3.C3  50.93,56.01 0 top
3.IC0  62.25,58.77 270 top
4.T4  66.8,71 180 top
5.R0  7.62,13.34 270 top
5.R1  10.16,31.75 90 top
5.R2  12.7,13.34 270 top
5.R3  15.24,31.75 90 top
5.R4  17.78,13.34 270 top
5.R5  22.86,13.34 270 top
5.R6  20.32,31.75 90 top
5.R7  25.4,31.75 90 top
5.R8  39.37,13.34 270 top
5.R9  41.91,31.75 90 top
5.R10  44.45,13.34 270 top
5.R11  46.99,31.75 90 top
5.R12  49.53,13.34 270 top
5.R13  54.61,13.34 270 top
5.R14  52.07,31.75 90 top
5.R15  57.15,31.75 90 top
5.R16  67.31,13.34 270 top
5.R17  69.85,31.75 90 top
5.R18  72.39,13.34 270 top
5.R19  74.93,31.75 90 top
5.R20  77.47,13.34 270 top
5.R21  82.55,13.34 270 top
5.R22  80.01,31.75 90 top
5.R23  85.15,31.77 90 top
5.T0  3.81,6.35 0 top
5.T1  12.7,6.35 0 top
5.T2  21.59,6.35 0 top
5.T3  30.48,6.35 0 top
5.T4  39.37,6.35 0 top
5.T5  48.26,6.35 0 top
5.T6  57.15,6.35 0 top
5.T7  66.04,6.35 0 top
5.T8  74.93,6.35 0 top
5.T9  83.82,6.35 0 top
5.T10  92.71,6.35 0 top
5.T11  92.71,16.51 0 top
6.T0  92.98,60.46 0 top
6.T2  84.09,60.46 0 top
6.T4  78.74,71 180 top
6.T5  87.5,71 180 top
6.T6  96.27,71 180 top
6.T7  54.74,71 180 top
6.T8  45.85,71 180 top
7.T0  75.2,60.46 0 top
IC1  66.78,42.55 0 top
IC2  7.62,48.26 0 top
IC3  7.62,27.94 0 top
IC4  39.37,27.94 0 top
IC5  67.31,27.94 0 top

### Tracks (layer width: path | path; a pad name or v marks a point on that pad's centre or on a via)
!RESET  (via drill 0.61)
  Top 0.305: 1.MCU1.29 38.97,39.01 v38.99,38.99 | 34.04,36.7 v34.29,36.96 33.81,36.48 1.ISPC.RST
  Bottom 0.305: v38.99,38.99 38.99,37.59 38.35,36.96 v34.29,36.96
+3V3  (1 unrouted)
  Top 0.305: 1.MCU1.20 44.56,41.38 44.83,41.66 45.56,41.66 47.4,43.5
  pour Top: 81.53,61.98 88.77,61.98 89.28,61.47 89.28,59.18 88.9,58.8 83.57,58.8 81.28,56.52 63.63,56.52 62.36,57.78 62.23,57.91 56.52,57.91 56.52,59.56 67.06,59.56 68.2,58.42 80.9,58.42 81.41,58.93 81.41,61.98
  pour Top: 56.64,57.91 51.05,57.91 50.55,57.4 50.42,44.7 50.42,42.67 49.91,42.16 45.59,42.16 45.47,42.29 45.47,44.07 48.01,44.07 48.9,44.96 48.9,58.8 49.66,59.56 56.64,59.56 56.77,59.44
+5V
  Top 0.305: IC3.16 7.62,25.15 | IC3.14 12.7,25.27 | IC3.12 17.78,25.4 | IC3.10 22.86,25.27 | IC4.16 39.37,25.02 | IC4.14 44.45,25.15 | IC4.12 49.53,25.15 | IC4.10 54.61,25.27 | IC5.16 67.31,25.27 | IC5.14 72.39,25.27 | IC5.12 77.47,25.4 77.6,25.27 | IC5.10 82.55,28.07 82.3,28.32 82.3,25.53 | 1.ISPC.V+ 31.27,25.3 31.24,25.27 | IC1.20 67.76,49.08 67.69,49.15 | IC1.4 64.51,35.44 64.52,35.43 | 1.L1.1 57.63,39.78 57.66,39.75 | 1.MCU1.6 31.64,40.58 1.C1.1 | 1.MCU1.4 32.53,42.18 32.51,42.16
  pour Top: 84.84,42.29 84.07,42.29 83.31,41.66 83.31,39.88 78.11,39.88 73.53,35.31 65.28,35.31 64.77,34.8 64.77,25.27 63.12,25.27 62.99,34.92 62.74,35.18 56.77,35.18 56.77,37.34 72.39,37.34 76.45,41.4 81.53,41.53 81.53,44.58 84.84,44.58 84.96,44.45
  pour Top: 56.77,36.83 56.77,56.26 56.9,56.39 61.72,56.39 61.98,56.13 61.98,51.69 62.99,50.67 70.1,50.67 70.61,50.16 70.61,49.53 69.72,48.64 59.31,48.64 58.29,47.62 58.29,37.08 57.78,36.58 57.15,36.58 56.9,36.7
  pour Top: 29.08,25.27 29.08,35.43 29.84,36.2 30.99,36.2 32.77,37.97 32.77,42.67 32,43.43 31.11,43.43 30.86,43.18 30.86,38.99 29.59,37.72 28.7,37.72 27.69,36.7 27.69,25.15 28.96,25.15
  pour Top: 7.24,26.16 86.61,26.16 86.61,24.51 7.37,24.51 7.24,24.64 7.24,26.04
  pour Top: 56.9,39.24 49.53,39.24 49.53,40.26 56.9,40.26
+24V  (via drill 1)
  Top 0.305: IC2.16 7.62,45.97 | IC2.14 12.7,45.85 | IC2.12 17.78,45.85 | IC2.10 22.86,46.74 21.97,45.85
  Top 0.61: 12.7,46.99 IC2.14
  other vias: 22.1,45.47
  pour Bottom: 40.01,73.41 57.02,73.41 64.89,73.45 64.89,69.32 57.4,69.34 39.62,69.34 31.88,61.59 31.88,53.47 23.11,44.7 20.57,44.7 20.19,45.09 20.32,45.72 29.08,54.48 29.08,62.36
  pour Top: 6.73,46.61 24.13,46.61 24.64,46.1 23.11,44.58 7.11,44.58 6.73,44.96
ADC6  (via drill 0.61)
  Top 0.305: 1.MCU1.19 45.66,40.58 46.23,41.15 50.42,41.15 51.69,42.42 51.69,52.2 v52.45,52.96
  Bottom 0.305: v52.45,52.96 62.74,52.96 64.52,54.74 74.55,54.74 75.18,55.37 75.18,60.44 7.T0.1
ADC7  (via drill 0.61)
  Top 0.305: 1.MCU1.22 45.52,42.98 45.72,43.18 45.72,50.67 v47.62,52.58 47.75,52.45
  Bottom 0.305: v47.62,52.58 48.9,52.58 49.91,51.56 62.87,51.56 65.02,53.72 75.95,53.72 78.7,56.48 7.T0.2
AGND  (via drill 0.6)
  other vias: 42.6,65.1 59.1,67.4 69.1,72.4 69.1,67.4 76.6,67.4 84.1,67.4 89.1,67.4 89.1,73.8 84.1,73.8 76.6,73.8 49.1,66.3 30.9,68.5 23.4,68.5 13.4,68.6 3.4,68.5 2.5,54.5 12.5,54.5 22.5,54.5 37.5,54.5 30.8,73.5 23.3,73.5 13.3,73.5 5.8,73.5
  pour Top (rank 5): -1.4,78.16 -1.4,47.05 0.89,43.99 25.12,43.99 29.07,47.69 32,47.69 34.81,50.49 42.2,50.49 44.24,52.53 44.24,62.86 46.92,65.53 99.83,65.53 101.87,67.58 101.87,77.9 100.09,79.69 0.13,79.69
  pour Bottom (rank 6): 1.3,44.1 25.5,44.1 29.1,47.7 31.9,47.7 36.6,52.4 42.1,52.4 44.3,54.6 44.3,62.8 47,65.5 101.4,65.5 104,68.1 104,78.3 100.1,82.2 1.7,82.2 -5.3,75.2 -5.3,48.4 -1,44.1
AVCC
  Top 0.305: 1.MCU1.18 44.8,39.78 45.09,39.5 47.22,39.5 1.L1.2 1.C2.1
B0  (via drill 0.61)
  Top 0.305: 2.R0.2 8.19,32.7 9.27,33.78 9.27,34.54 v9.4,34.67 | 1.MCU1.12 38.97,36.34 v39.37,35.94
  Bottom 0.305: v9.4,34.67 15.24,34.67 17.78,37.21 32.64,37.21 33.91,35.94 v39.37,35.94
B1  (via drill 0.61)
  Top 0.305: 1.MCU1.13 39.77,38.37 40.26,38.86 v40.26,40.13 | v15.11,36.07 15.11,35.69 14.1,34.67 14.1,33.53 13.27,32.7 2.R2.2
  Bottom 0.305: v40.26,40.13 38.73,40.13 37.85,39.24 37.85,38.48 37.47,38.1 17.14,38.1 v15.11,36.07
B2
  Top 0.305: IC4.11 5.R14.1 49.59,30.8 48.9,31.5 48.9,33.66 48.26,34.29 44.58,34.29 43.94,34.92 40.89,34.92 40.57,35.25 1.MCU1.14
B6  (via drill 0.61)
  Top 0.305: 2.R6.2 23.82,32.7 24.13,33.02 v24.13,40.01 | v33.66,39.65 35.05,39.75 1.MCU1.7
  Bottom 0.305: v24.13,40.01 26.67,40.01 27.3,39.37 33.27,39.37 v33.66,39.65
B7  (via drill 0.61)
  Top 0.305: 1.MCU1.8 v36.57,38.98 v36.58,38.99 | v19.05,40.26 19.05,33.02 18.8,32.77 17.84,32.77 2.R4.2
  Bottom 0.305: v36.58,38.99 34.92,38.99 34.67,38.73 20.57,38.73 v19.05,40.26
C0  (via drill 0.61)
  Top 0.305: IC4.9 5.R15.1 55.69,30.8 54.74,31.75 v53.84,32.65 | 1.MCU1.23 42.51,43.78 42.04,43.31 42.04,39.88 v41.91,39.75
  Bottom 0.305: v41.91,39.75 41.91,38.99 43.43,37.47 50.44,37.47 54.2,33.7 v53.84,32.65
C1  (via drill 0.61)
  Top 0.305: IC5.15 5.R17.1 69.75,30.7 66.6,30.7 65.5,29.6 v65.5,28.3 | 1.MCU1.24 41.48,44.58 v41.4,44.5
  Bottom 0.305: v41.4,44.5 44.2,44.5 59.9,28.8 65,28.8 v65.5,28.3
C2  (via drill 0.61)
  Top 0.305: IC5.13 5.R19.1 74.53,30.4 v72.4,30.4 | 1.MCU1.25 44.38,46.08 v44.4,46.1
  Bottom 0.305: v44.4,46.1 44.4,45.6 60.4,29.6 71.6,29.6 v72.4,30.4
C3  (via drill 0.61)
  Top 0.305: IC5.11 5.R22.1 79.51,30.3 v77.2,30.3 | 1.MCU1.26 41.37,46.97 41.7,47.3 44.2,47.3 v44.5,47.6
  Bottom 0.305: v44.5,47.6 45.2,47.6 46.3,46.5 46.3,45.1 60.8,30.6 70.7,30.6 71.7,31.6 74.3,31.6 75.6,30.3 v77.2,30.3
C4  (via drill 0.61)
  Top 0.305: 1.MCU1.27 40.57,47.17 v40.6,47.9 | v82.8,30.6 84.93,30.6 5.R23.1 85.15,28 IC5.9
  Bottom 0.305: v40.6,47.9 43.1,47.9 43.9,48.7 45.2,48.7 47.6,46.3 47.6,45.3 60.4,32.5 80.9,32.5 v82.8,30.6
D2  (via drill 0.61)
  Top 0.305: IC3.15 5.R1.1 10.99,30.8 11.43,31.24 v11.43,41.27 | v34.04,46.1 36.54,46.1 1.MCU1.32
  Bottom 0.305: v34.04,46.1 33.4,45.47 30.61,45.47 27.81,42.67 12.95,42.67 11.56,41.27 v11.43,41.27
D3  (via drill 0.61)
  Top 0.305: IC3.13 5.R3.1 16.07,30.8 16.51,31.24 16.51,40.01 v16.64,40.13 | 33.4,44.58 v33.27,44.45 33.41,44.58 1.MCU1.1
  Bottom 0.305: v33.27,44.45 33.15,44.58 31.11,44.58 28.57,42.04 18.54,42.04 v16.64,40.13
D4  (via drill 0.61)
  Top 0.305: IC3.11 5.R6.1 21.27,30.8 21.46,30.99 21.46,36.7 21.59,36.83 v21.59,40.89 | v33.53,43.18 34.13,43.78 1.MCU1.2
  Bottom 0.305: v33.53,43.18 33.27,43.43 31.75,43.43 29.21,40.89 v21.59,40.89
D5  (via drill 0.61)
  Top 0.305: IC3.9 5.R7.1 26.48,30.8 26.92,31.24 26.92,34.67 v26.29,35.31 | v32.26,36.2 32.26,36.83 33.4,37.97 35.43,37.97 35.81,37.59 36.47,37.59 1.MCU1.9
  Bottom 0.305: v26.29,35.31 31.37,35.31 v32.26,36.2
D6
  Top 0.305: IC4.15 5.R9.1 41.85,30.86 39.37,30.86 37.37,32.86 1.MCU1.10
D7
  Top 0.305: IC4.13 5.R11.1 44.64,30.8 43.81,31.62 43.81,33.91 43.56,34.16 39.62,34.16 38.17,35.62 1.MCU1.11
GND  (via drill 0.6)
  other vias: 4.4,25 5,30 5,35 5,40 14.5,40.9 9.3,40.5 12.9,30.4 17.8,30.3 22.9,30.3 36.8,28.4 36,33.1 39.6,32.9 40.3,42.3 37.3,42.3 35.3,47.8 47.2,48.6 50,35 54.1,30.3 59.3,27.6 53.9,44.9 90,25 95,30 95,35 95,45 77.5,50 90,52.5 80,37.5 77.5,35 67.3,34 61.1,33.8 70,62.5 65,62.5 55,62.5 47.5,60 47.5,55 67.5,42.5 48.7,30 55,23.3 22.5,23.3 82.5,23.3 72.5,42.5
  pour Top (rank 6): -1.4,42.71 25.88,42.71 29.58,46.41 32.26,46.41 35.19,49.34 42.97,49.34 45.39,51.77 45.39,62.35 47.3,64.26 100.72,64.26 102.64,62.35 102.51,24.86 100.72,22.57 -0.26,22.57 -1.91,23.08 -1.91,42.2
  pour Bottom: 26,42.9 29.7,46.6 32.1,46.6 36.8,51.3 42.9,51.3 45.3,53.7 45.3,62.3 47.5,64.5 101.6,64.5 103.6,62.5 100.4,22.6 -0.7,22.6 -2.6,42.1 -1.8,42.9
MISO  (via drill 0.61)
  Top 0.305: v43.43,35.94 1.MCU1.16
  Bottom 0.305: 1.ISPC.MISO 33.77,27.83 32.51,29.08 32.51,31.11 33.02,31.62 40.92,31.62 43.43,34.13 v43.43,35.94
MOSI  (via drill 0.61)
  Top 0.305: v32.64,34.54 32.64,31.74 1.ISPC.MOSI | 1.MCU1.15 41.37,35.97 v41.66,35.94
  Bottom 0.305: v41.66,35.94 41.4,35.56 40.39,34.54 v32.64,34.54
N$1  (1 unrouted)
  Top 0.61: 28,61 28,68.27 2.T2.1
N$2
  Top 0.61: 2.U5.2 38.1,67.06 2.T3.1
N$3  (via drill 0.61)  (1 unrouted)
  Top 0.305: v72.77,46.86 71.75,46.86 70.99,46.1 70.99,45.97
  Bottom 0.305: 0.CON1.D+ 86.34,40.87 87.88,42.42 87.88,44.32 85.98,46.23 73.41,46.23 v72.77,46.86
N$4  (via drill 0.61)
  Top 0.305: v70.36,43.94 IC1.16
  Bottom 0.305: 0.CON1.D- 84.1,40.87 81.08,43.89 81.08,43.92 80.8,44.2 76.35,44.19 75.95,44.2 74.04,44.2 73.91,44.32 70.74,44.32 v70.36,43.94
N$5
  Top 0.305: IC2.11 20.32,49.21 2.R5.2 21.91,52.31 23.91,54.31 2.U4.1
N$6
  Top 0.305: IC2.9 26.36,48.26 2.R7.2 28.89,51.25 29.72,52.07 33.56,52.07 2.U5.1
N$7
  Top 0.305: 0.C4.1 72.67,50.07 69.71,47.1 IC1.17
N$8
  Top 0.61: 2.U3.2 17.78,69.6 2.T1.1
N$9
  Top 0.305: IC2.13 15.24,50.48 2.R3.2 15.56,54.23 2.U3.1
N$10
  Top 0.61: 2.U2.2 7.62,70.87 2.T0.1
N$11
  Top 0.305: IC2.15 10.16,49.85 2.R1.2 8.83,50.8 2.U2.1
N$12
  Top 0.61: 5.R4.1 IC3.5
N$14
  Top 0.61: IC3.7 5.R5.1
N$15
  Top 0.61: 5.R2.1 IC3.3
N$16
  Top 0.305: IC2.1 2.R0.1
N$17
  Top 0.305: IC2.7 2.R6.1
N$18
  Top 0.61: 5.R2.2 5.T1.1
N$19
  Top 0.305: 2.R4.1 IC2.5
N$20
  Top 0.61: 5.R0.1 IC3.1
N$21
  Top 0.305: 2.R2.1 IC2.3
N$22
  Top 0.61: IC3.2 10.16,9.2 5.T0.2
N$23
  Top 0.61: 5.T1.2 16.2,9.07 15.62,9.65 15.37,9.91 15.24,10.03 IC3.4
N$24
  Top 0.61: 5.R0.2 7.05,12.38 4.83,10.16 4.32,9.65 3.81,9.14 5.T0.1
N$25
  Top 0.61: IC3.8 27.94,17.78 33.98,11.74 5.T3.2
N$26
  Top 0.61: 5.R5.2 27.87,12.38 30.48,9.78 5.T3.1
N$27
  Top 0.61: IC3.6 20.32,10.67 21.72,9.27 23.11,9.27 24.13,8.26 24.38,8 25.09,7.29 5.T2.2
N$28
  Top 0.61: 5.R4.2 17.78,10.16 5.T2.1
N$29
  Top 0.61: IC4.1 5.R8.1
N$30
  Top 0.61: 5.R10.1 IC4.3
N$31
  Top 0.61: IC4.4 46.99,10.41 48.26,9.14 50.42,9.14 51.76,7.8 5.T5.2
N$32
  Top 0.61: 5.R10.2 44.45,10.16 5.T5.1
N$33
  Top 0.61: IC4.2 41.91,7.31 5.T4.2
N$34
  Top 0.61: 5.R8.2 5.T4.1
N$35
  Top 0.61: 5.R12.1 IC4.5
N$36
  Top 0.61: IC4.7 5.R13.1
N$37
  Top 0.61: 5.T7.2 69.54,7.04 67.56,9.02 65.91,9.02 65.53,9.4 64.77,10.16 IC4.8
N$38
  Top 0.61: 5.T7.1 65.66,6.35 59.62,12.38 5.R13.2
N$39
  Top 0.61: IC4.6 52.07,12.06 53.98,10.16 58.29,10.16 60.65,7.8 5.T6.2
N$40
  Top 0.61: 5.R12.2 49.97,12.38 56.01,6.35 5.T6.1
N$41
  Top 0.61: 5.R16.1 IC5.1
N$42
  Top 0.61: 5.R18.1 72.39,17.65 72.52,17.78 IC5.3
N$43  (1 unrouted)
  Top 0.61: IC5.4 74.93,11.68 75.82,10.79 78.23,10.79 79.5,9.53 81.66,9.53 82.8,8.38 85.34,8.38 87.38,6.35
N$44
  Top 0.61: 5.T9.1 83.06,6.35 81.15,8.26 78.99,8.26 77.6,9.65 74.04,9.65 72.39,11.3 5.R18.2
N$45  (1 unrouted)
  Top 0.61: IC5.2 69.85,12.06 73.53,8.38 76.45,8.38 78.49,6.35
N$46
  Top 0.61: 5.R16.2 67.5,12.38 73.53,6.35 5.T8.1
N$47
  Top 0.61: IC5.5 5.R20.1
N$48
  Top 0.61: IC5.7 5.R21.1
N$49
  Top 0.61: IC5.8 88.77,17.78 90.3,19.3 93.42,19.3 5.T11.2
N$50
  Top 0.61: 5.R21.2 82.61,12.38 83.95,10.95 89.15,10.95 92.71,14.61 5.T11.1
N$51  (via drill 0.61)
  Top 0.61: IC5.6 v80.01,13.46
  Bottom 0.61: v80.01,13.46 83.57,9.91 94.36,9.91 96.14,8.13 96.14,6.42 5.T10.2
N$52
  Top 0.61: 5.R20.2 78.29,12.38 80.01,10.67 82.3,10.67 83.19,9.78 89.28,9.78 5.T10.1
RXD  (via drill 0.61)
  Top 0.305: v60.07,45.09 60.07,44.07 62.61,41.53 62.56,41.48 IC1.1 | v39.37,48.26 38.17,47.06 1.MCU1.30
  Bottom 0.305: v60.07,45.09 56.01,49.15 48.77,49.15 47.37,50.55 44.58,50.55 42.93,48.9 40.01,48.9 v39.37,48.26
SCK  (via drill 0.61)  (1 unrouted)
  Top 0.305: v45.09,35.94 45.09,37.62 43.7,39
  Bottom 0.305: 1.ISPC.SCK 39.64,30.37 41.02,30.35 42.45,30.35 45.09,32.98 v45.09,35.94
TXD  (via drill 0.61)
  Top 0.305: IC1.5 65.16,40.63 61.47,44.32 61.47,45.97 v60.33,47.12 | v39.12,49.91 38.35,49.15 38.35,48.51 37.37,47.53 1.MCU1.31
  Bottom 0.305: v60.33,47.12 60.33,47.24 57.53,50.04 48.77,50.04 47.5,51.31 44.32,51.31 42.67,49.66 39.37,49.66 v39.12,49.91

### Text on the board
Document: "Relays" | Power input | ADC | Inputs
tDocu: v.25.01.2012 | USB-IO CARD | Savpek Electronics | Savpek Electronics